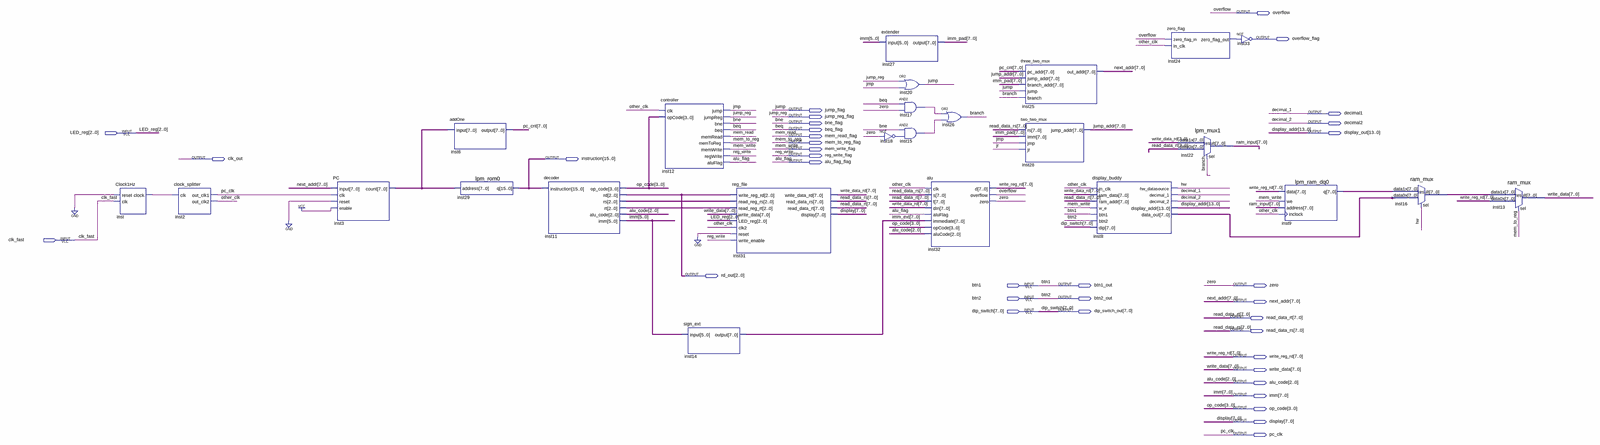
[diagram p0: schematic sheet, whole]
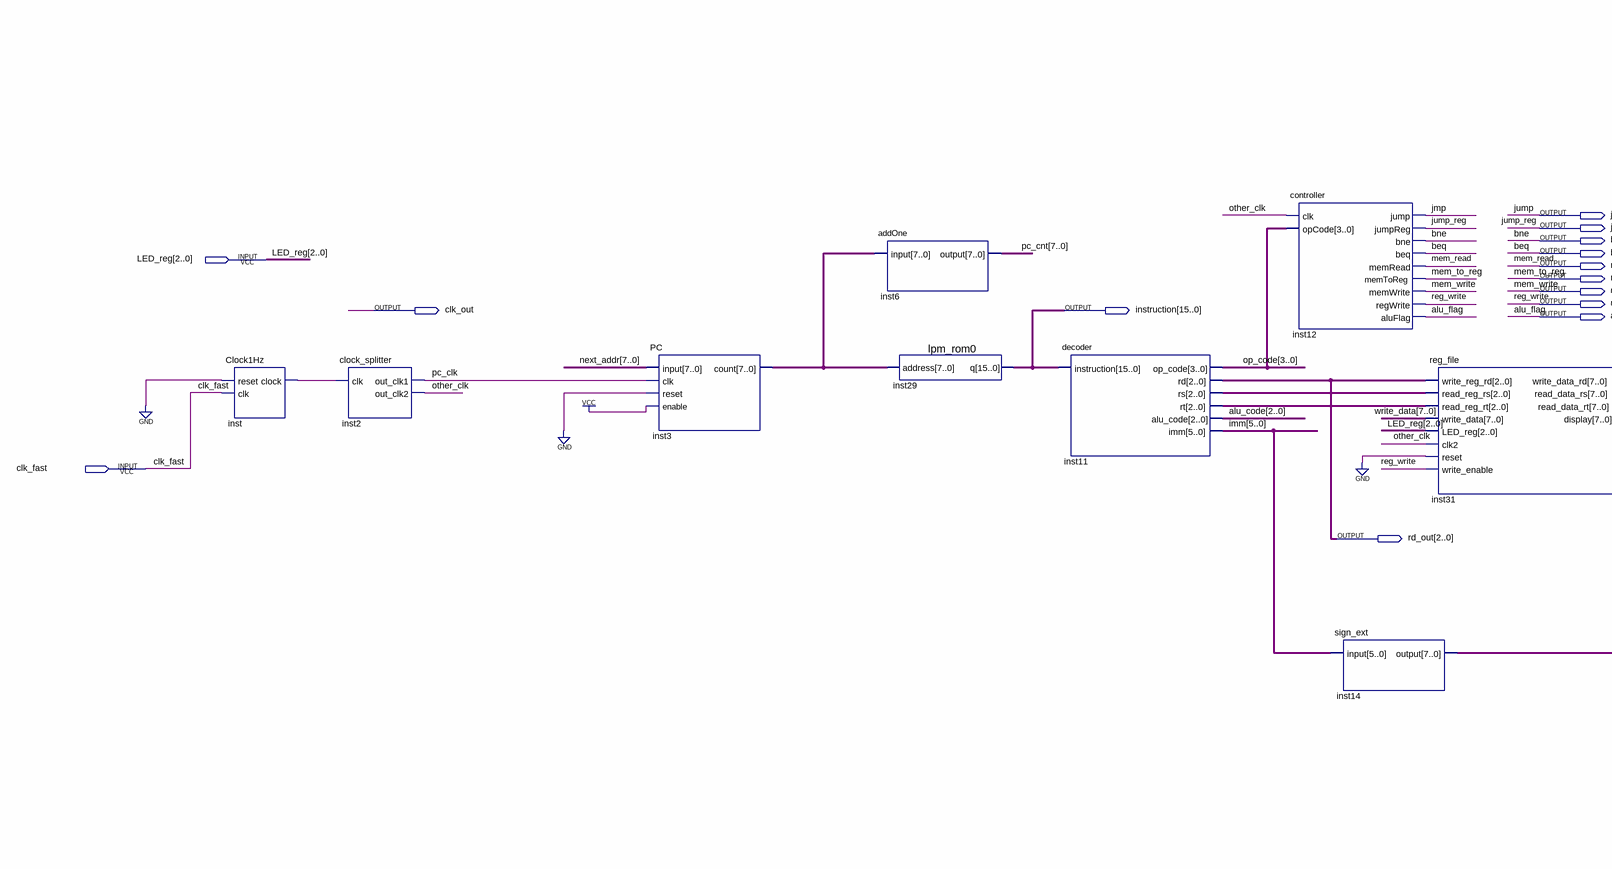
[diagram p1: schematic sheet, left part]
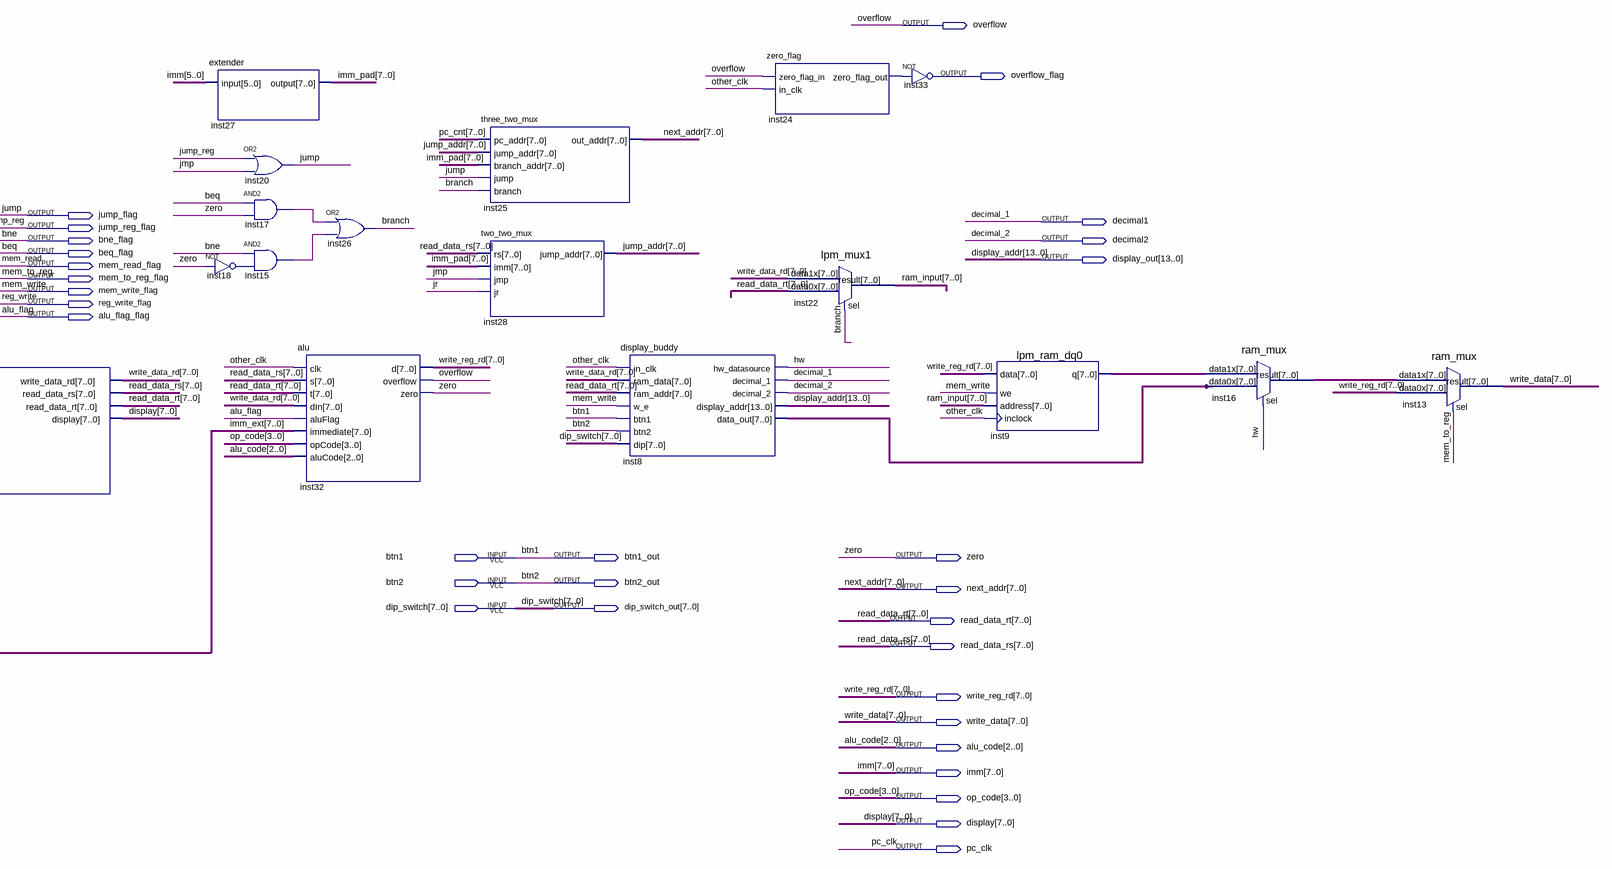
[diagram p2: schematic sheet, right part]
// Quartus schematic processor.bdf as structural Verilog: 25 symbols, 36 pins
module processor (
  input  [2:0] LED_reg,
  input  clk_fast,
  input  btn1,
  input  btn2,
  input  [7:0] dip_switch,
  output overflow,
  output overflow_flag,
  output jump_flag,
  output decimal1,
  output jump_reg_flag,
  output bne_flag,
  output decimal2,
  output beq_flag,
  output [13:0] display_out,
  output mem_read_flag,
  output mem_to_reg_flag,
  output mem_write_flag,
  output reg_write_flag,
  output clk_out,
  output [15:0] instruction,
  output alu_flag_flag,
  output [2:0] rd_out,
  output btn1_out,
  output zero,
  output btn2_out,
  output [7:0] next_addr,
  output [7:0] dip_switch_out,
  output [7:0] read_data_rt,
  output [7:0] read_data_rs,
  output [7:0] write_reg_rd,
  output [7:0] write_data,
  output [2:0] alu_code,
  output [7:0] imm,
  output [3:0] op_code,
  output [7:0] display,
  output pc_clk
);

  wire branch, hw, inst15_out, inst17_out, inst18_out, inst24_zero_flag_out, inst_clock, jmp, jr, other_clk;
  wire [2:0] inst11_rs, inst11_rt;
  wire [7:0] imm_ext, imm_pad, inst3_count, inst8_data_out, inst9_q, inst16_result, jump_addr, pc_cnt,
       ram_input, write_data_rd;

  Clock1Hz inst (.reset(1'b0), .clk(clk_fast), .clock(inst_clock));
  clock_splitter inst2 (.clk(inst_clock), .out_clk1(pc_clk), .out_clk2(other_clk));
  PC inst3 (.\input (next_addr), .clk(pc_clk), .reset(1'b0), .enable(1'b1), .count(inst3_count));
  addOne inst6 (.\input (inst3_count), .\output (pc_cnt));
  lpm_rom0 inst29 (.address(inst3_count), .q(instruction));
  decoder inst11 (
    .instruction(instruction), .op_code(op_code), .rd(rd_out), .rs(inst11_rs), .rt(inst11_rt),
    .alu_code(alu_code), .imm(imm[5:0]));
  controller inst12 (
    .clk(other_clk), .opCode(op_code), .jump(jmp), .jumpReg(jump_reg_flag), .bne(bne_flag), .beq(beq_flag),
    .memRead(mem_read_flag), .memToReg(mem_to_reg_flag), .memWrite(mem_write_flag),
    .regWrite(reg_write_flag), .aluFlag(alu_flag_flag));
  sign_ext inst14 (.\input (imm[5:0]), .\output (imm_ext));
  reg_file inst31 (
    .write_reg_rd(rd_out), .read_reg_rs(inst11_rs), .read_reg_rt(inst11_rt), .write_data(write_data),
    .LED_reg(LED_reg), .clk2(other_clk), .reset(1'b0), .write_enable(reg_write_flag),
    .write_data_rd(write_data_rd), .read_data_rs(read_data_rs), .read_data_rt(read_data_rt), .display(display));
  extender inst27 (.\input (imm[5:0]), .\output (imm_pad));
  or inst20 (jump_flag, jump_reg_flag, jmp);
  and inst17 (inst17_out, beq_flag, zero);
  and inst15 (inst15_out, bne_flag, inst18_out);
  not inst18 (inst18_out, zero);
  alu inst32 (
    .clk(other_clk), .s(read_data_rs), .t(read_data_rt), .dIn(write_data_rd), .aluFlag(alu_flag_flag),
    .immediate(imm_ext), .opCode(op_code), .aluCode(alu_code), .d(write_reg_rd), .overflow(overflow),
    .zero(zero));
  or inst26 (branch, inst17_out, inst15_out);
  three_two_mux inst25 (
    .pc_addr(pc_cnt), .jump_addr(jump_addr), .branch_addr(imm_pad), .jump(jump_flag), .branch(branch),
    .out_addr(next_addr));
  two_two_mux inst28 (.rs(read_data_rs), .imm(imm_pad), .jmp(jmp), .jr(jr), .jump_addr(jump_addr));
  display_buddy inst8 (
    .in_clk(other_clk), .ram_data(write_data_rd), .ram_addr(read_data_rt), .w_e(mem_write_flag), .btn1(btn1),
    .btn2(btn2), .dip(dip_switch), .hw_datasource(hw), .decimal_1(decimal1), .decimal_2(decimal2),
    .display_addr(display_out), .data_out(inst8_data_out));
  zero_flag inst24 (.zero_flag_in(overflow), .in_clk(other_clk), .zero_flag_out(inst24_zero_flag_out));
  lpm_mux1 inst22 (.data1x(write_data_rd), .data0x(read_data_rt), .sel(branch), .result(ram_input));
  not inst33 (overflow_flag, inst24_zero_flag_out);
  lpm_ram_dq0 inst9 (.data(write_reg_rd), .we(mem_write_flag), .address(ram_input), .inclock(other_clk), .q(inst9_q));
  ram_mux inst16 (.data1x(inst9_q), .data0x(inst8_data_out), .sel(hw), .result(inst16_result));
  ram_mux inst13 (.data1x(inst16_result), .data0x(write_reg_rd), .sel(mem_to_reg_flag), .result(write_data));

  assign btn1_out = btn1;
  assign btn2_out = btn2;
  assign dip_switch_out = dip_switch;

  // Other names for the same wires on the sheet: alu_flag = alu_flag_flag; beq = beq_flag; bne = bne_flag;
  //   decimal_1 = decimal1; decimal_2 = decimal2; display_addr[13:0] = display_out; jump = jump_flag;
  //   jump_reg = jump_reg_flag; mem_read = mem_read_flag; mem_to_reg = mem_to_reg_flag; mem_write = mem_write_flag;
  //   reg_write = reg_write_flag
endmodule
